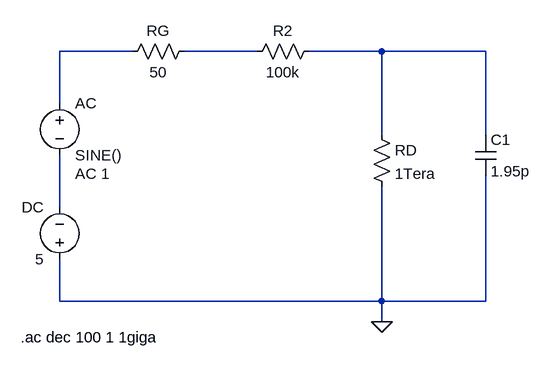
[diagram p0: schematic Bode de modelo RC.asc]
Bode de modelo RC.asc, the LTspice schematic file:
Version 4
SHEET 1 880 680
WIRE 96 16 -16 16
WIRE 288 16 176 16
WIRE 480 16 368 16
WIRE 640 16 480 16
WIRE -16 96 -16 16
WIRE 480 144 480 16
WIRE 640 144 640 16
WIRE -16 256 -16 176
WIRE -16 400 -16 336
WIRE 480 400 480 224
WIRE 480 400 -16 400
WIRE 640 400 640 208
WIRE 640 400 480 400
WIRE 480 432 480 400
FLAG 480 432 0
SYMBOL voltage -16 352 R180
WINDOW 0 24 96 Left 2
WINDOW 3 24 16 Left 2
SYMATTR InstName DC
SYMATTR Value 5
SYMBOL voltage -16 80 R0
WINDOW 123 24 124 Left 2
WINDOW 39 0 0 Left 0
SYMATTR InstName AC
SYMATTR Value SINE()
SYMATTR Value2 AC 1
SYMBOL res 384 0 R90
WINDOW 0 0 56 VBottom 2
WINDOW 3 32 56 VTop 2
SYMATTR InstName R2
SYMATTR Value 100k
SYMBOL res 464 128 R0
SYMATTR InstName RD
SYMATTR Value 1Tera
SYMBOL cap 624 144 R0
SYMATTR InstName C1
SYMATTR Value 1.95p
SYMBOL res 192 0 R90
WINDOW 0 0 56 VBottom 2
WINDOW 3 32 56 VTop 2
SYMATTR InstName RG
SYMATTR Value 50
TEXT -76 456 Left 2 !.ac dec 100 1 1giga

The netlist it stands for:
* Bode de modelo RC.asc
V§DC 0 N004 5
V§AC N001 N004 SINE() AC 1
R2 N003 N002 100k
RD N003 0 1Tera
C1 N003 0 1.95p
RG N002 N001 50
.ac dec 100 1 1giga
.backanno
.end